# EAGLE design logic-level (EAGLE 8.6.0)
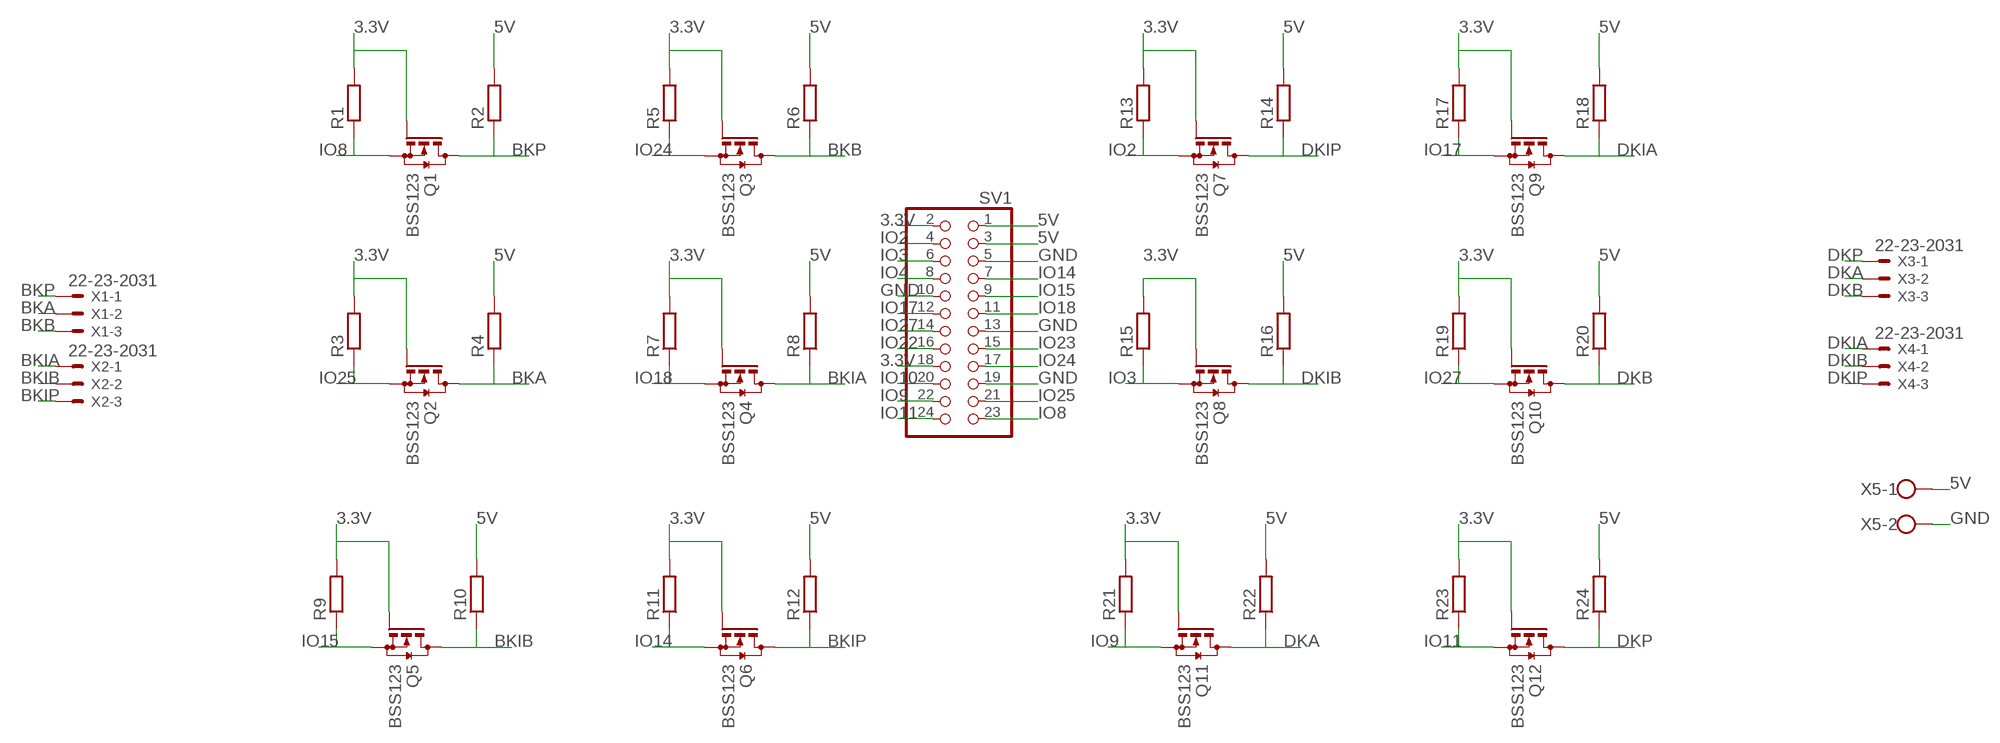
[diagram p0: schematic, sheet 1]

## Parts
Q1  BSS123  [SOT23]
Q2  BSS123  [SOT23]
Q3  BSS123  [SOT23]
Q4  BSS123  [SOT23]
Q5  BSS123  [SOT23]
Q6  BSS123  [SOT23]
Q7  BSS123  [SOT23]
Q8  BSS123  [SOT23]
Q9  BSS123  [SOT23]
Q10  BSS123  [SOT23]
Q11  BSS123  [SOT23]
Q12  BSS123  [SOT23]
R1  R-EU_M1206  [M1206]
R2  R-EU_M1206  [M1206]
R3  R-EU_M1206  [M1206]
R4  R-EU_M1206  [M1206]
R5  R-EU_M1206  [M1206]
R6  R-EU_M1206  [M1206]
R7  R-EU_M1206  [M1206]
R8  R-EU_M1206  [M1206]
R9  R-EU_M1206  [M1206]
R10  R-EU_M1206  [M1206]
R11  R-EU_M1206  [M1206]
R12  R-EU_M1206  [M1206]
R13  R-EU_M1206  [M1206]
R14  R-EU_M1206  [M1206]
R15  R-EU_M1206  [M1206]
R16  R-EU_M1206  [M1206]
R17  R-EU_M1206  [M1206]
R18  R-EU_M1206  [M1206]
R19  R-EU_M1206  [M1206]
R20  R-EU_M1206  [M1206]
R21  R-EU_M1206  [M1206]
R22  R-EU_M1206  [M1206]
R23  R-EU_M1206  [M1206]
R24  R-EU_M1206  [M1206]
SV1  PINHD-2X12  [2X12]
X1  22-23-2031  [22-23-2031]
X2  22-23-2031  [22-23-2031]
X3  22-23-2031  [22-23-2031]
X4  22-23-2031  [22-23-2031]
X5  W237-102  [W237-102]

## Nets
3.3V: Q1.1(G) Q2.1(G) Q3.1(G) Q4.1(G) Q5.1(G) Q6.1(G) Q7.1(G) Q8.1(G) Q9.1(G) Q10.1(G) Q11.1(G) Q12.1(G) R1.2 R3.2 R5.2 R7.2 R9.2 R11.2 R13.2 R15.2 R17.2 R19.2 R21.2 R23.2 SV1.2 SV1.18
5V: R2.2 R4.2 R6.2 R8.2 R10.2 R12.2 R14.2 R16.2 R18.2 R20.2 R22.2 R24.2 SV1.1 SV1.3 X5.1
BKA: Q2.3(D) R4.1 X1.2
BKB: Q3.3(D) R6.1 X1.3
BKIA: Q4.3(D) R8.1 X2.1
BKIB: Q5.3(D) R10.1 X2.2
BKIP: Q6.3(D) R12.1 X2.3
BKP: Q1.3(D) R2.1 X1.1
DKA: Q11.3(D) R22.1 X3.2
DKB: Q10.3(D) R20.1 X3.3
DKIA: Q9.3(D) R18.1 X4.1
DKIB: Q8.3(D) R16.1 X4.2
DKIP: Q7.3(D) R14.1 X4.3
DKP: Q12.3(D) R24.1 X3.1
GND: SV1.5 SV1.10 SV1.13 SV1.19 X5.2
IO2: Q7.2(S) R13.1 SV1.4
IO3: Q8.2(S) R15.1 SV1.6
IO4: SV1.8
IO8: Q1.2(S) R1.1 SV1.23
IO9: Q11.2(S) R21.1 SV1.22
IO10: SV1.20
IO11: Q12.2(S) R23.1 SV1.24
IO14: Q6.2(S) R11.1 SV1.7
IO15: Q5.2(S) R9.1 SV1.9
IO17: Q9.2(S) R17.1 SV1.12
IO18: Q4.2(S) R7.1 SV1.11
IO22: SV1.16
IO23: SV1.15
IO24: Q3.2(S) R5.1 SV1.17
IO25: Q2.2(S) R3.1 SV1.21
IO27: Q10.2(S) R19.1 SV1.14

## Library data of the parts
Q1-Q12 = transistor-small-signal:BSS123: N-CHANNEL MOS FET
R1-R24 = resistor:R-EU_: RESISTOR, European symbol
SV1 = pinhead:PINHD-2X12: PIN HEADER
X1-X4 = con-molex:22-23-2031: .100" (2.54mm) Center Header - 3 Pin; MF: MOLEX; MPN: 22-23-2031; OC_FARNELL: 1462950; OC_NEWARK: 30C0862
X5 = con-wago-500:W237-102: WAGO SCREW CLAMP; MPN: 237-102; OC_FARNELL: unknown; OC_NEWARK: 70K9898

## Board
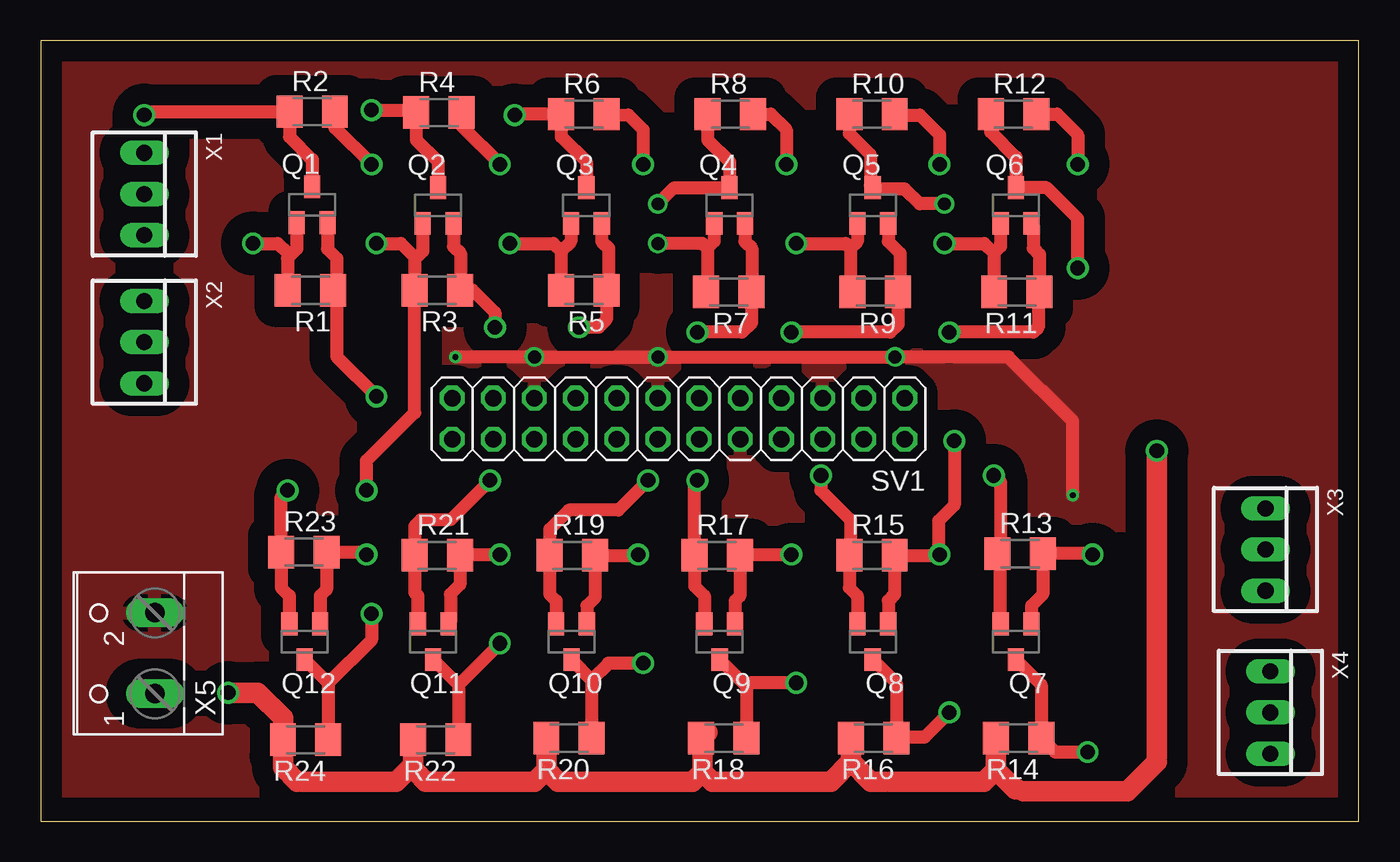
[diagram p1: board, top side]
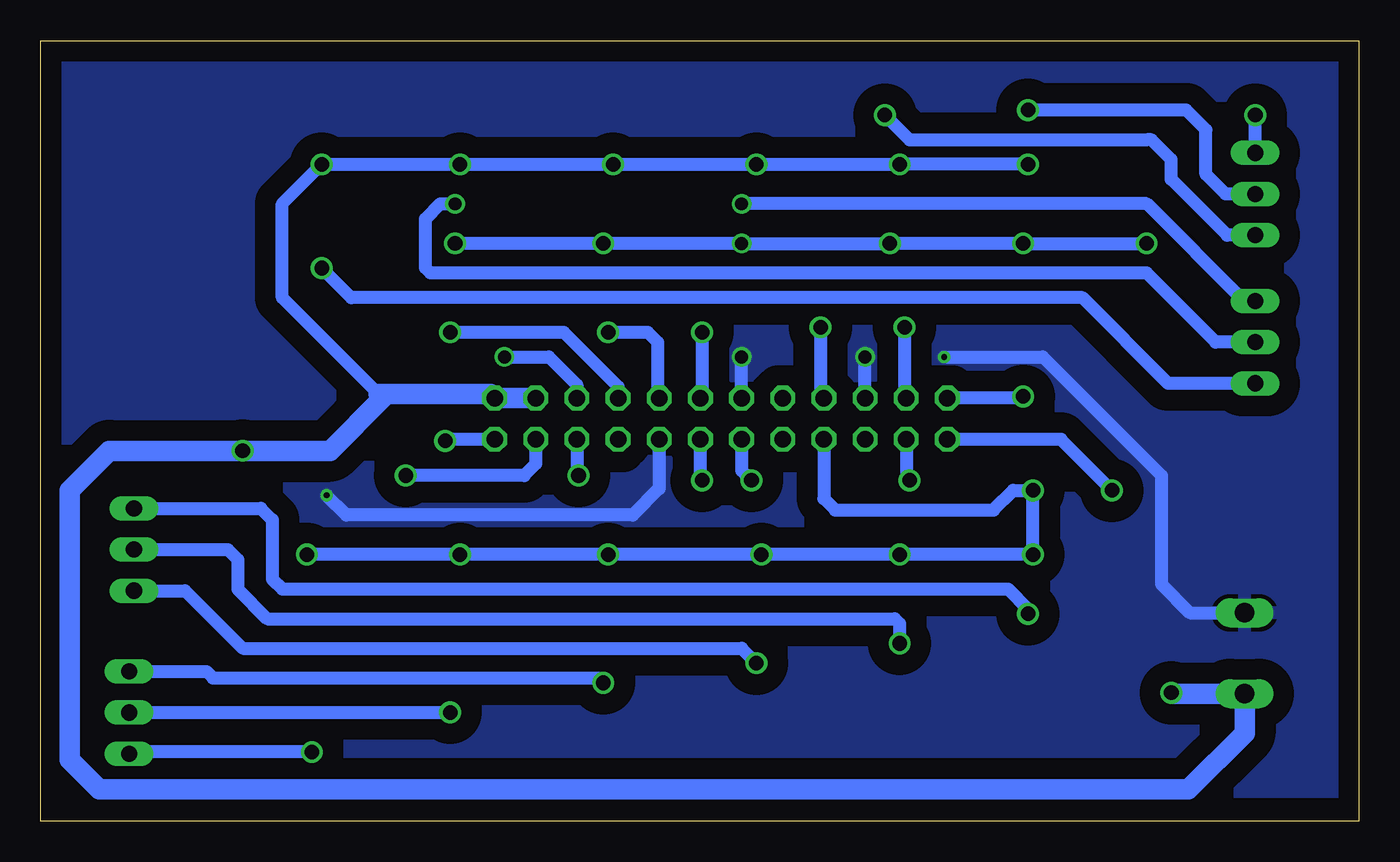
[diagram p2: board, bottom side, seen from below]

Size 81.36 x 48.18 mm. Coordinates in mm from the lower left corner, seen from the top.
Outline: 0,0 81.36,0 81.36,48.18 0,48.18 0,0
Copper layers (1*16): Top 0.035mm / dielectric 1.5mm / Bottom 0.035mm
Design rules "default": minimum track width 6mil, minimum drill 0.35mm, track to track 6mil, track to pad 6mil, pad to pad 6mil, via to via 6mil, smd to smd 6mil, copper to edge 40mil, drill to drill 6mil, minimum pad ring 10mil, minimum via ring 8mil, stop-mask expansion 4mil, vias tented up to drill 0mil, thermal gap 10mil

### Footprints (pad centres in the part's own frame; a part is rotated, then mirrored left to right if it is on the bottom)
SOT23 = smd 1 x 1.4: 1 -0.95,-1.1; 2 0.95,-1.1; 3 0,1.1
M1206 = smd 1.6 x 2: 1 -1.4,0; 2 1.4,0
2X12 = drill 1.016 octagon: 1 -13.97,-1.27; 2 -13.97,1.27; 3 -11.43,-1.27; 4 -11.43,1.27; 5 -8.89,-1.27; 6 -8.89,1.27; 7 -6.35,-1.27; 8 -6.35,1.27; 9 -3.81,-1.27; 10 -3.81,1.27; 11 -1.27,-1.27; 12 -1.27,1.27; 13 1.27,-1.27; 14 1.27,1.27; 15 3.81,-1.27; 16 3.81,1.27; 17 6.35,-1.27; 18 6.35,1.27; 19 8.89,-1.27; 20 8.89,1.27; 21 11.43,-1.27; 22 11.43,1.27; 23 13.97,-1.27; 24 13.97,1.27
22-23-2031 = drill 1 long: 1 -2.54,0; 2 0,0; 3 2.54,0
W237-102 = drill 1.194 long: 1 -2.5,-1.27; 2 2.5,-1.27

### Placement (x,y rotation side)
Q1  16.76,38.05 0 top
Q2  24.54,38 0 top
Q3  33.68,38 0 top
Q4  42.52,38 0 top
Q5  51.36,38 0 top
Q6  60.2,38 0 top
Q7  60.2,11.07 180 top
Q8  51.36,11.07 180 top
Q9  41.91,11.07 180 top
Q10  32.77,11.07 180 top
Q11  24.23,11.07 180 top
Q12  16.31,11.07 180 top
R1  16.66,32.77 180 top
R2  16.76,43.79 0 top
R3  24.49,32.77 180 top
R4  24.59,43.74 0 top
R5  33.53,32.77 180 top
R6  33.53,43.64 0 top
R7  42.47,32.66 180 top
R8  42.57,43.64 0 top
R9  51.51,32.66 180 top
R10  51.31,43.64 0 top
R11  60.25,32.66 180 top
R12  60.05,43.64 0 top
R13  60.45,16.51 0 top
R14  60.35,5.13 180 top
R15  51.31,16.41 0 top
R16  51.41,5.13 180 top
R17  41.76,16.41 0 top
R18  42.16,5.13 180 top
R19  32.82,16.41 0 top
R20  32.61,5.13 180 top
R21  24.49,16.41 0 top
R22  24.38,5.03 180 top
R23  16.26,16.61 0 top
R24  16.36,5.03 180 top
SV1  39.37,24.84 180 top
X1  6.4,38.71 270 top
X2  6.4,29.57 270 top
X3  75.59,16.76 270 top
X4  75.9,6.71 270 top
X5  5.79,10.36 90 top

### Tracks (layer width: path | path; a pad name or v marks a point on that pad's centre or on a via)
3.3V  (via drill 0.8, 0.9)
  Top 0.813: Q1.1 15.81,35.32 15.24,34.75 | 15.24,34.75 15.24,32.79 R1.2 | Q2.1 23.59,35.17 23.09,34.67 | 23.09,34.67 R3.2 23.09,25.22 20.12,22.25 v20.12,20.42 | Q3.1 32.73,35.78 32.13,35.18 | 32.13,35.18 R5.2 | v28.96,35.66 31.64,35.66 32.13,35.18 | v20.73,35.66 22.25,35.66 23.09,34.83 23.09,34.67 | v13.11,35.66 14.63,35.66 15.24,35.05 15.24,34.75 | Q4.1 41.57,35.78 41.15,35.36 | 41.15,35.36 40.84,35.66 v38.1,35.66 | 41.15,35.36 41.15,32.74 R7.2 | Q5.1 50.41,35.78 49.99,35.36 | 49.99,35.36 49.99,32.79 R9.2 | 49.99,35.36 49.68,35.66 v46.63,35.66 | Q6.1 59.25,35.47 58.83,35.05 | 58.83,35.05 58.83,32.69 R11.2 | 58.83,35.05 58.22,35.66 v55.78,35.66 | Q7.1 61.15,13.29 61.85,14 R13.2 64.87,16.51 v64.92,16.46 | Q8.1 52.31,13.6 52.71,14 R15.2 55.42,16.41 | Q9.1 42.86,13.6 43.16,13.9 R17.2 43.21,16.46 v46.33,16.46 | Q10.1 33.72,13.29 34.22,13.8 R19.2 36.83,16.41 v36.88,16.46 | Q11.1 25.3,12.29 25.3,14.02 25.89,14.61 R21.2 25.94,16.46 v28.35,16.46 | Q12.1 17.26,13.9 17.66,14.3 R23.2 19.96,16.61 v20.12,16.46 | 55.42,16.41 v55.47,16.46 | v56.39,23.47 56.39,19.51 55.42,18.54 55.42,16.41
  Bottom 0.813: v13.11,35.66 v20.73,35.66 v28.96,35.66 v38.1,35.66 v46.63,35.66 v55.78,35.66 | v64.92,16.46 v55.47,16.46 v46.33,16.46 v36.88,16.46 v28.35,16.46 v20.12,16.46 v20.12,20.42 21.34,20.42 22.55,19.2 32.31,19.2 33.02,19.91 SV1.18 | SV1.2 56.29,23.57 v56.39,23.47
5V  (via drill 0.9)
  Top 0.813: R2.2 18.16,42.8 v20.42,40.54 | R6.2 36.27,43.59 37.19,42.67 v37.19,40.54 | R8.2 45.06,43.64 46.03,42.67 v46.03,40.54 | R10.2 52.76,43.59 54.25,43.59 55.47,42.37 v55.47,40.54 | R12.2 62.74,43.64 64.01,42.37 v64.01,40.54 | R4.2 25.99,42.9 v28.35,40.54 | 15.85,2.44 16.15,2.44 | 21.95,2.44 22.86,3.35 23.16,3.05 | 31.21,4.57 R20.2 | 52.12,2.44 52.43,2.44 | 68.88,3.66 68.88,3.96 | 60.29,1.83 60.66,1.83
  Top 1.27: v11.58,7.93 13.41,7.93 14.96,6.38 R24.2 14.96,3.33 15.85,2.44 | 16.15,2.44 21.95,2.44 22.98,3.48 R22.2 | 23.16,3.05 23.77,2.44 30.48,2.44 31.21,3.17 | 31.21,3.17 31.21,4.57 | 31.21,3.17 31.95,2.44 40.23,2.44 40.84,3.05 | 40.84,3.05 40.84,5.18 | 40.84,5.18 41.15,5.49 | 40.84,5.18 40.79,5.13 R18.2 | 40.84,3.05 41.45,2.44 48.77,2.44 50.01,3.68 | 50.01,3.68 R16.2 | 50.01,3.68 51.25,2.44 52.12,2.44 | 52.43,2.44 58.22,2.44 58.95,3.17 | 58.95,3.17 R14.2 | 58.95,3.17 60.17,1.96 60.29,1.96 | 60.66,1.83 67.06,1.83 68.88,3.66 | 68.88,3.96 v68.88,22.86
  Bottom 0.813: v20.42,40.54 v28.35,40.54 v37.19,40.54 v46.03,40.54 v55.47,40.54 v64.01,40.54 66.45,38.1 66.45,32.31 60.5,26.37 60.25,26.11 SV1.1
  Bottom 1.27: 60.25,26.11 63.5,22.86 v68.88,22.86 77.11,22.86 79.55,20.42 79.55,3.78 77.72,1.96 10.54,1.96 7.06,5.44 X5.1 11.52,7.86 v11.58,7.93 | 60.5,26.37 53.59,26.37 SV1.1 SV1.3
BKA  (via drill 0.9)
  Top 0.813: Q2.3 24.54,40.69 23.19,42.04 R4.1 23.04,43.89 v20.42,43.89
  Bottom 0.813: v20.42,43.89 10.67,43.89 9.45,42.67 9.45,39.93 8.23,38.71 X1.2
BKB  (via drill 0.9)
  Top 0.813: Q3.3 33.68,40.69 32.13,42.24 R6.1 29.31,43.64 v29.26,43.59
  Bottom 0.813: v29.26,43.59 27.74,42.06 13.72,42.06 13.11,42.06 12.8,42.06 11.58,40.84 11.58,39.62 8.13,36.17 X1.3
BKIA  (via drill 0.8)
  Top 0.813: R8.1 41.17,42.04 42.52,40.69 Q4.3 39.1,39.1 v38.1,38.1
  Bottom 0.813: X2.1 7.11,32.11 13.11,38.1 v38.1,38.1
BKIB  (via drill 0.8)
  Top 0.813: R10.1 49.91,42.45 51.21,41.15 51.21,39.25 Q5.3 51.44,39.01 53.34,39.01 54.25,38.1 v55.78,38.1
  Bottom 0.813: X2.2 8.84,29.57 13.11,33.83 57.3,33.83 57.61,34.14 57.61,37.19 56.69,38.1 v55.78,38.1
BKIP  (via drill 0.9)
  Top 0.813: R12.1 58.65,42.55 60.2,41 Q6.3 62.09,39.1 64.01,37.19 v64.01,34.14
  Bottom 0.813: X2.3 11.79,27.03 17.07,32.31 62.18,32.31 v64.01,34.14
BKP  (via drill 0.9)
  Top 0.813: Q1.3 16.76,40.84 15.36,42.24 R2.1 10.67,43.79 6.6,43.79 v6.4,43.59
  Bottom 0.813: X1.1 v6.4,43.59
DKA  (via drill 0.9)
  Top 0.813: Q11.3 25.78,8.42 | 25.78,8.42 R22.1 | v28.35,10.97 25.8,8.42 25.78,8.42
  Bottom 0.813: X3.2 69.8,16.76 69.19,16.15 69.19,14.33 67.36,12.5 28.65,12.5 28.35,12.19 v28.35,10.97
DKB  (via drill 0.9)
  Top 0.813: Q10.3 34.01,8.73 | 34.01,8.73 R20.1 | 34.01,8.73 35.04,9.75 v37.19,9.75
  Bottom 0.813: X3.3 72.44,14.22 68.88,10.67 38.1,10.67 v37.19,9.75
DKIA  (via drill 0.9)
  Top 0.813: Q9.3 43.56,8.32 | 43.56,8.32 R18.1 | v46.63,8.53 43.78,8.53 43.56,8.32
  Bottom 0.813: X4.1 71.12,9.25 70.71,8.84 46.94,8.84 v46.63,8.53
DKIB  (via drill 0.9)
  Top 0.813: Q8.3 52.81,8.52 R16.1 52.86,5.18 54.56,5.18 v56.08,6.71
  Bottom 0.813: X4.2 v56.08,6.71
DKIP  (via drill 0.9)
  Top 0.813: Q7.3 61.75,8.42 R14.1 62.61,4.27 v64.62,4.27
  Bottom 0.813: v64.62,4.27 75.79,4.27 X4.3
DKP  (via drill 0.9)
  Top 0.813: Q12.3 17.76,8.52 | 17.76,8.52 R24.1 | v20.42,12.8 20.42,11.19 17.76,8.52
  Bottom 0.813: X3.1 67.77,19.3 67.06,18.59 67.06,14.94 66.45,14.33 21.64,14.33 20.42,13.11 v20.42,12.8
GND  (via drill 0.35, 0.8)
  Top 0.813: v63.7,20.12 63.7,24.69 59.74,28.65 v52.73,28.65 v38.1,28.65 v30.48,28.65 v25.6,28.65
  Bottom 0.813: SV1.13 v38.1,28.65 | v52.73,28.65 49.99,28.65 48.26,26.92 SV1.5 | SV1.19 v30.48,28.65 | SV1.10 43.18,20.52 44.81,18.9 62.48,18.9 v63.7,20.12 | v25.6,28.65 19.51,28.65 12.19,21.34 12.19,14.63 10.43,12.86 X5.2
  pour Top (isolate 1.27): 1.22,46.94 79.86,46.94 79.86,1.83 1.22,1.83
  pour Bottom (isolate 1.27): 1.52,47.55 79.55,47.55 79.86,47.24 79.86,1.83 1.22,1.83 1.22,47.55 1.52,47.24
IO2  (via drill 0.9)
  Top 0.813: Q7.2 59.25,16.31 | 59.25,16.31 R13.1 | v58.83,21.34 59.25,20.91 59.25,16.31
  Bottom 0.813: SV1.4 50.8,22.05 51.51,21.34 v58.83,21.34
IO3  (via drill 0.9)
  Top 0.813: Q8.2 50.41,13.9 49.91,14.41 R15.1 49.99,16.49 49.99,18.59 48.16,20.42 v48.16,21.34
  Bottom 0.813: SV1.6 48.26,21.44 v48.16,21.34
IO8  (via drill 0.9)
  Top 0.813: Q1.2 17.71,35.32 18.29,34.75 18.29,32.99 | 18.29,32.99 R1.1 | 18.29,32.99 18.29,28.65 v20.73,26.21
  Bottom 0.813: v20.73,26.21 20.83,26.11 SV1.23
IO9  (via drill 0.9)
  Top 0.813: Q11.2 23.28,13.9 23.09,14.1 R21.1 23.09,18.21 23.47,18.59 25.3,18.59 v27.74,21.03
  Bottom 0.813: SV1.22 27.94,21.23 v27.74,21.03
IO11  (via drill 0.9)
  Top 0.813: Q12.2 15.36,13.9 14.86,14.41 R23.1 14.86,20.04 v15.24,20.42
  Bottom 0.813: v15.24,20.42 18.39,23.57 SV1.24
IO14  (via drill 0.9)
  Top 0.813: Q6.2 61.27,36.78 61.27,35.36 61.65,34.97 R11.1 61.57,32.59 61.57,30.48 61.27,30.18 v56.08,30.18
  Bottom 0.813: v56.08,30.18 49.07,30.18 45.72,26.82 SV1.7
IO15  (via drill 0.9)
  Top 0.813: Q5.2 52.31,35.78 53.03,35.05 53.03,32.79 R9.1 52.91,30.66 52.43,30.18 v46.33,30.18
  Bottom 0.813: SV1.9 43.28,26.21 43.28,29.57 43.89,30.18 v46.33,30.18
IO17  (via drill 0.9)
  Top 0.813: Q9.2 40.96,13.9 40.36,14.51 R17.1 40.36,20.85 v40.54,21.03
  Bottom 0.813: v40.54,21.03 40.64,21.13 SV1.12
IO18  (via drill 0.9)
  Top 0.813: Q4.2 43.47,35.78 43.89,35.36 43.89,32.69 R7.1 43.87,30.81 43.89,30.79 43.28,30.18 v40.54,30.18
  Bottom 0.813: v40.54,30.18 40.54,26.21 SV1.11
IO24  (via drill 0.9)
  Top 0.813: Q3.2 34.63,35.78 35.05,35.36 35.05,32.89 R5.1 34.93,30.97 34.44,30.48 v33.22,30.48
  Bottom 0.813: v33.22,30.48 33.22,26.31 SV1.17
IO25  (via drill 0.9)
  Top 0.813: Q2.2 25.49,35.47 25.91,35.05 25.91,32.79 | 25.91,32.79 R3.1 | 25.91,32.79 26.65,32.79 28.04,31.39 v28.04,30.48
  Bottom 0.813: v28.04,30.48 28.04,26.21 SV1.21
IO27  (via drill 0.9)
  Top 0.813: Q10.2 31.82,13.6 31.42,14 R19.1 31.42,18.01 32.61,19.2 35.66,19.2 v37.49,21.03
  Bottom 0.813: SV1.14 38.1,21.64 v37.49,21.03